# Altium project OPAMP_TESTER.PrjPcb
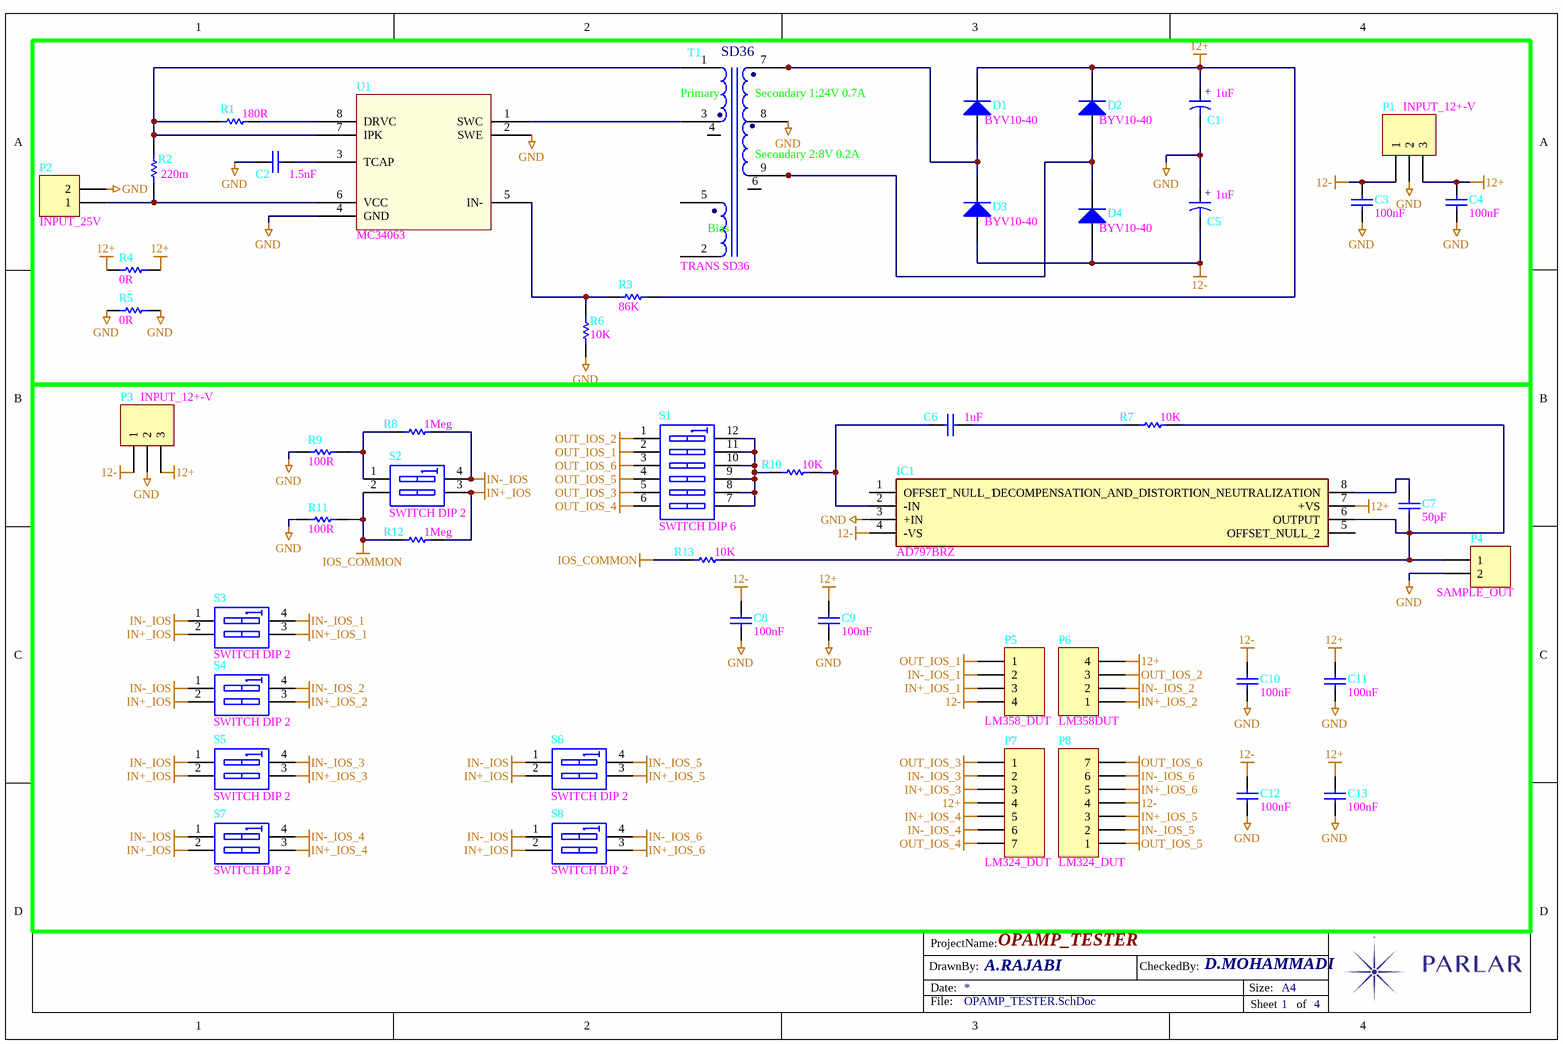
[diagram p0: OPAMP_TESTER.SchDoc]
4 sheets, 139 parts. Net scope: global (net labels, ports and power ports of the same name join across sheets).
Board files: OPAMP_TESTER.PcbDoc, OPAMP_TESTERh.PcbDoc
Sheets:
  OPAMP_TESTER.SchDoc
  OPAMP_TESTER_1.SchDoc
  OPAMP_TESTER_2.SchDoc
  OPAMP_TESTER_3.SchDoc

## Sheet OPAMP_TESTER.SchDoc: OPAMP_TESTER
size A4; CheckedBy: D.MOHAMMADI; DrawnBy: A.RAJABI; SheetNumber: 1; SheetTotal: 4

### Parts
C1  1uF  [CAP EL D06.3 P2.5]
C2  1.5nF  [SMD 0805]
C3  100nF  [SMD 0805]
C4  100nF  [SMD 0805]
C5  1uF  [CAP EL D06.3 P2.5]
C6  1uF  [SMD 1206]
C7  50pF  [SMD 1206]
C8  100nF  [SMD 0805]
C9  100nF  [SMD 0805]
C10  100nF  [SMD 0805]
C11  100nF  [SMD 0805]
C12  100nF  [SMD 0805]
C13  100nF  [SMD 0805]
D1  BYV10-40  [SMD SMA]
D2  BYV10-40  [SMD SMA]
D3  BYV10-40  [SMD SMA]
D4  BYV10-40  [SMD SMA]
IC1  AD797BRZ  [SOIC127P600X175-8N]
P1  INPUT_12+-V  [CON XH 3]
P2  INPUT_25V  [CON XH RA 2]
P3  INPUT_12+-V  [CON XH 3]
P4  SAMPLE_OUT  [CON XH 2]
P5  LM358_DUT  [CON HDR 2.54FM 4]
P6  LM358DUT  [CON HDR 2.54FM 4]
P7  LM324_DUT  [CON HDR 2.54FM 7]
P8  LM324_DUT  [CON HDR 2.54FM 7]
R1  180R  [SMD 0805]
R2  220m  [SMD 0805]
R3  86K  [SMD 1206]
R4  0R  [SMD 1206]
R5  0R  [SMD 1206]
R6  10K  [SMD 0805]
R7  10K  [SMD 0805]
R8  1Meg  [SMD 0805]
R9  100R  [SMD 0805]
R10  10K  [SMD 1206]
R11  100R  [SMD 0805]
R12  1Meg  [SMD 0805]
R13  10K  [SMD 0805]
S1  SWITCH DIP 6  [SWITCH DIP 6]
S2  SWITCH DIP 2  [SWITCH DIP 2]
S3  SWITCH DIP 2  [SWITCH DIP 2]
S4  SWITCH DIP 2  [SWITCH DIP 2]
S5  SWITCH DIP 2  [SWITCH DIP 2]
S6  SWITCH DIP 2  [SWITCH DIP 2]
S7  SWITCH DIP 2  [SWITCH DIP 2]
S8  SWITCH DIP 2  [SWITCH DIP 2]
T1  TRANS SD36  [TR EC28/20 VER 5+5]
U1  MC34063  [SMD IC SOP8]

### Nets
12+: C1.1 C4.2 C9.2 C11.2 C13.2 D1.2 D2.2 IC1.7(+VS) P1.3 P3.3 P6.4 P7.4 R3.2 R4.1 R4.2
12-: C3.2 C5.2 C8.2 C10.2 C12.2 D3.1 D4.1 IC1.4(-VS) P1.1 P3.1 P5.4 P8.4
GND: C1.2 C2.1 C3.1 C4.1 C5.1 C8.1 C9.1 C10.1 C11.1 C12.1 C13.1 IC1.3(+IN) P1.2 P2.2 P3.2 P4.2 R5.1 R5.2 R6.2 R9.1 R11.1 T1.8 U1.2(SWE) U1.4(GND)
IN+_IOS: R12.2 S2.3(B2) S3.2(A2) S4.2(A2) S5.2(A2) S6.2(A2) S7.2(A2) S8.2(A2)
IN+_IOS_1: P5.3 S3.3(B2)
IN+_IOS_2: P6.1 S4.3(B2)
IN+_IOS_3: P7.3 S5.3(B2)
IN+_IOS_4: P7.5 S7.3(B2)
IN+_IOS_5: P8.3 S6.3(B2)
IN+_IOS_6: P8.5 S8.3(B2)
IN-_IOS: R8.2 S2.4(B1) S3.1(A1) S4.1(A1) S5.1(A1) S6.1(A1) S7.1(A1) S8.1(A1)
IN-_IOS_1: P5.2 S3.4(B1)
IN-_IOS_2: P6.2 S4.4(B1)
IN-_IOS_3: P7.2 S5.4(B1)
IN-_IOS_4: P7.6 S7.4(B1)
IN-_IOS_5: P8.2 S6.4(B1)
IN-_IOS_6: P8.6 S8.4(B1)
IOS_COMMON: R11.2 R12.1 R13.1 S2.2(A2)
OUT_IOS_1: P5.1 S1.2(A2)
OUT_IOS_2: P6.3 S1.1(A1)
OUT_IOS_3: P7.1 S1.5(A5)
OUT_IOS_4: P7.7 S1.6(A6)
OUT_IOS_5: P8.1 S1.4(A4)
OUT_IOS_6: P8.7 S1.3(A3)
NetC2_2: C2.2 U1.3(TCAP)
NetC6_1: C6.1 R7.1
NetC6_2: C6.2 IC1.2(-IN) R10.2
NetC7_1: C7.1 IC1.8(DECOMPENSATION_AND_DISTORTION_NEUTRALIZATION)
NetC7_2: C7.2 IC1.6(OUTPUT) P4.1 R7.2 R13.2
NetD1_1: D1.1 D3.2 T1.6 T1.7
NetD2_1: D2.1 D4.2 T1.9 T1.10
NetP2_1: P2.1 R2.2 U1.6(VCC)
NetR1_1: R1.1 R2.1 T1.1 U1.7(IPK)
NetR1_2: R1.2 U1.8(DRVC)
NetR3_1: R3.1 R6.1 U1.5(IN-)
NetR8_1: R8.1 R9.2 S2.1(A1)
NetR10_1: R10.1 S1.7(B6) S1.8(B5) S1.9(B4) S1.10(B3) S1.11(B2) S1.12(B1)
NetT1_3: T1.3 U1.1(SWC)

Not connected (* = marked no-connect by the designer): IC1 1(OFFSET_NULL_1) 5(OFFSET_NULL_2); T1 2 4 5

### Notes on the sheet
- DrawnBy:
- ProjectName:
- Date:
- CheckedBy:
- Size:
- A4
- File:
- Sheet
- of
- (in symbol CAP POL) +
- (in symbol TRANS SD36) SD36; .; Primary; Secondary 1:24V 0.7A; Secondary 2:8V 0.2A; Bias

### Library data of the parts
C1 C5 = CAP POL: Capacitor  Polarized; Published: 23-Sep-2002; PackageReference: CAPR5-4X5; Publisher: Altium Limited; PackageDescription: Capacitor; 2 Leads; Parameter 1: *
C2-C4 C6-C13 = CAP: Capacitor; Published: 8-Jun-2000; LatestRevisionDate: 17-Jul-2002; LatestRevisionNote: Re-released for DXP Platform.; PackageReference: RAD-0.3; Publisher: Altium Limited; PackageDescription: Radial Cap, Thru-Hole; 2 Leads; 0.3 in Pin Spacing
D1-D4 = DIODE: Typical Diode
IC1 = AD797BRZ: Integrated Circuit; Manufacturer_Name: Analog Devices; Datasheet Link: http://www.analog.com/static/imported-files/data_sheets/AD797.pdf; Height: 1.75mm; Manufacturer_Part_Number: AD797BRZ; Mouser Part Number: 584-AD797BRZ; Mouser Price/Stock: https://www.mouser.co.uk/ProductDetail/Analog-Devices/AD797BRZ?qs=%2FtpEQrCGXCwnXZ1Ropaiug%3D%3D; Arrow Part Number: AD797BRZ; Arrow Price/Stock: https://www.arrow.com/en/products/ad797brz/analog-devices?region=nac
P1 P3 = CONNECTOR 3: Header, 3-Pin; LatestRevisionDate: 17-Jul-2002; LatestRevisionNote: Re-released for DXP Platform.; Publisher: Altium Limited
P2 P4 = CONNECTOR 2: Header, 2-Pin; LatestRevisionDate: 17-Jul-2002; LatestRevisionNote: Re-released for DXP Platform.; Publisher: Altium Limited
P5 P6 = CONNECTOR 4: Header, 4-Pin; LatestRevisionDate: 17-Jul-2002; LatestRevisionNote: Re-released for DXP Platform.; Publisher: Altium Limited
P7 P8 = CONNECTOR 7: Header, 7-Pin; LatestRevisionDate: 17-Jul-2002; LatestRevisionNote: Re-released for DXP Platform.; Publisher: Altium Limited
R1-R13 = RES: Resistor
S1 = SWITCH DIP 6: DIP Switch, 6 Position, SPST; Published: 24-Mar-1999; LatestRevisionDate: 17-Jul-2002; LatestRevisionNote: Re-released for DXP Platform.; PackageReference: DIP-12/SW; Publisher: Altium Limited; PackageDescription: DIP Switch; 12 Leads
S2-S8 = SWITCH DIP 2: DIP Switch, 2 Position, SPST; Published: 24-Mar-1999; LatestRevisionDate: 17-Jul-2002; LatestRevisionNote: Re-released for DXP Platform.; PackageReference: DIP-4; Publisher: Altium Limited
T1 = TRANS SD36: Transformer
U1 = IC MC34063

## Sheet OPAMP_TESTER_1.SchDoc
size A4; SheetNumber: 2; SheetTotal: 4
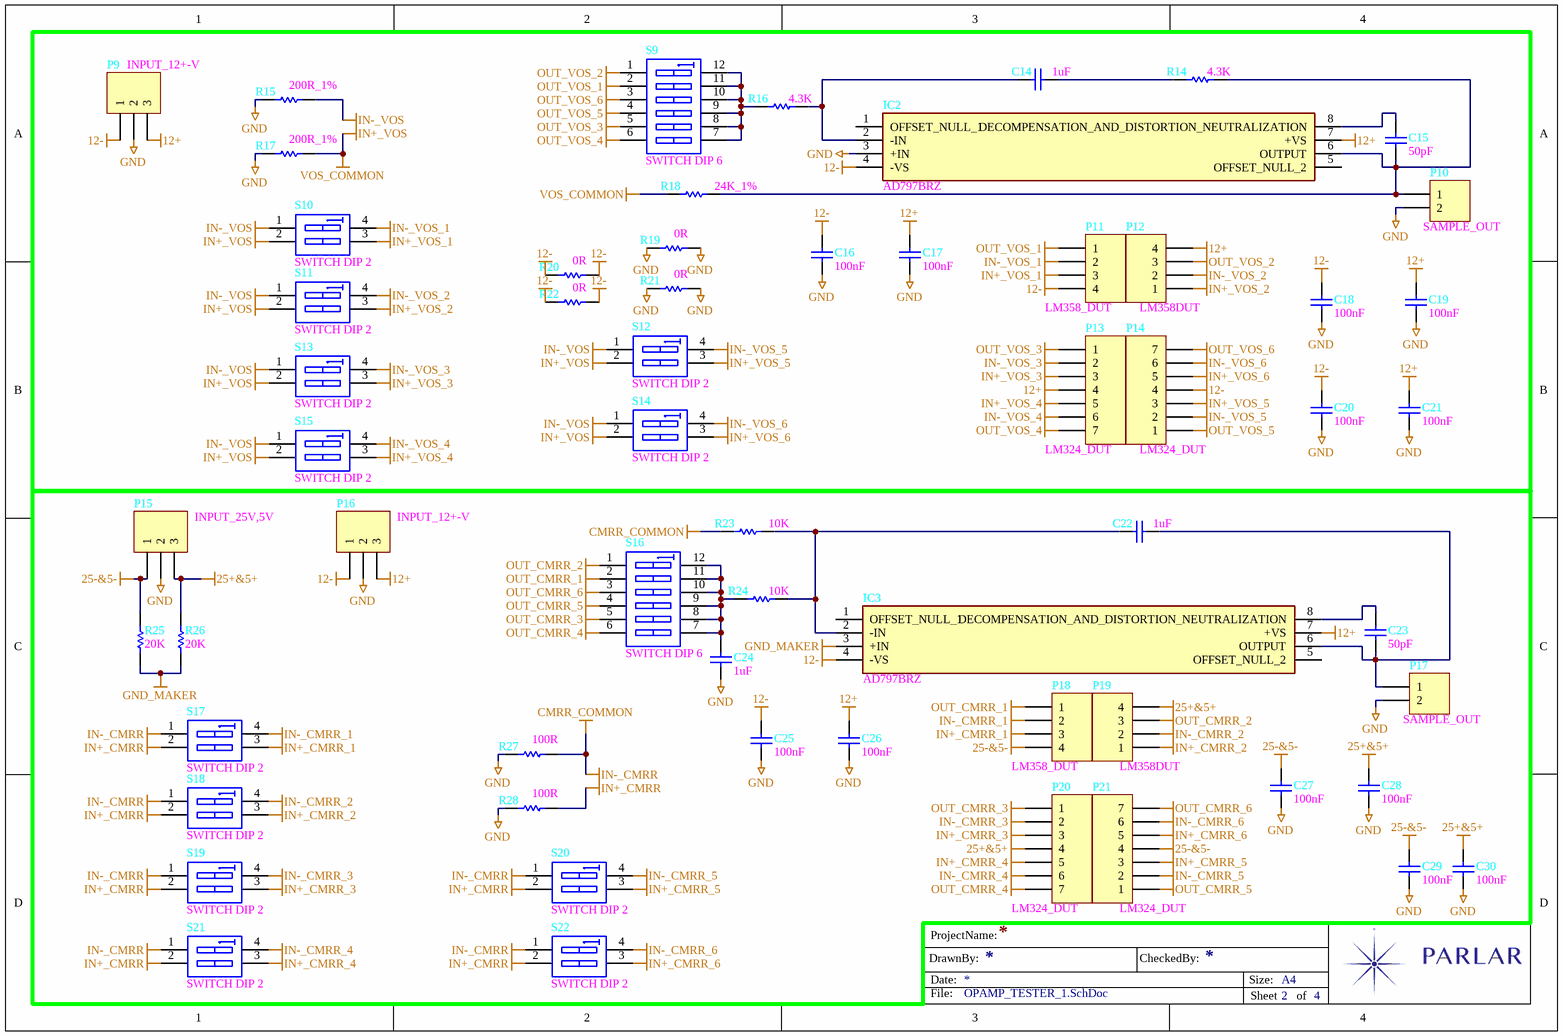
[diagram p1: OPAMP_TESTER_1.SchDoc]

### Parts
C14  1uF  [SMD 1206]
C15  50pF  [SMD 1206]
C16  100nF  [SMD 0805]
C17  100nF  [SMD 0805]
C18  100nF  [SMD 0805]
C19  100nF  [SMD 0805]
C20  100nF  [SMD 0805]
C21  100nF  [SMD 0805]
C22  1uF  [SMD 1206]
C23  50pF  [SMD 1206]
C24  1uF  [SMD 0805]
C25  100nF  [SMD 0805]
C26  100nF  [SMD 0805]
C27  100nF  [SMD 0805]
C28  100nF  [SMD 0805]
C29  100nF  [SMD 0805]
C30  100nF  [SMD 0805]
IC2  AD797BRZ  [SOIC127P600X175-8N]
IC3  AD797BRZ  [SOIC127P600X175-8N]
P9  INPUT_12+-V  [CON XH 3]
P10  SAMPLE_OUT  [CON XH 2]
P11  LM358_DUT  [CON HDR 2.54FM 4]
P12  LM358DUT  [CON HDR 2.54FM 4]
P13  LM324_DUT  [CON HDR 2.54FM 7]
P14  LM324_DUT  [CON HDR 2.54FM 7]
P15  INPUT_25V,5V  [CON XH 3]
P16  INPUT_12+-V  [CON XH 3]
P17  SAMPLE_OUT  [CON XH 2]
P18  LM358_DUT  [CON HDR 2.54FM 4]
P19  LM358DUT  [CON HDR 2.54FM 4]
P20  LM324_DUT  [CON HDR 2.54FM 7]
P21  LM324_DUT  [CON HDR 2.54FM 7]
R14  4.3K  [SMD 0805]
R15  200R_1%  [SMD 0805]
R16  4.3K  [SMD 1206]
R17  200R_1%  [SMD 0805]
R18  24K_1%  [SMD 0805]
R19  0R  [SMD 1206]
R20  0R  [SMD 1206]
R21  0R  [SMD 1206]
R22  0R  [SMD 1206]
R23  10K  [SMD 0805]
R24  10K  [SMD 0805]
R25  20K  [SMD 0805]
R26  20K  [SMD 0805]
R27  100R  [SMD 0805]
R28  100R  [SMD 0805]
S9  SWITCH DIP 6  [SWITCH DIP 6]
S10  SWITCH DIP 2  [SWITCH DIP 2]
S11  SWITCH DIP 2  [SWITCH DIP 2]
S12  SWITCH DIP 2  [SWITCH DIP 2]
S13  SWITCH DIP 2  [SWITCH DIP 2]
S14  SWITCH DIP 2  [SWITCH DIP 2]
S15  SWITCH DIP 2  [SWITCH DIP 2]
S16  SWITCH DIP 6  [SWITCH DIP 6]
S17  SWITCH DIP 2  [SWITCH DIP 2]
S18  SWITCH DIP 2  [SWITCH DIP 2]
S19  SWITCH DIP 2  [SWITCH DIP 2]
S20  SWITCH DIP 2  [SWITCH DIP 2]
S21  SWITCH DIP 2  [SWITCH DIP 2]
S22  SWITCH DIP 2  [SWITCH DIP 2]

### Nets
12+: C17.2 C19.2 C21.2 C26.2 IC2.7(+VS) IC3.7(+VS) P9.3 P12.4 P13.4 P16.3
12-: C16.2 C18.2 C20.2 C25.2 IC2.4(-VS) IC3.4(-VS) P9.1 P11.4 P14.4 P16.1 R20.1 R20.2 R22.1 R22.2
25+&5+: C28.2 C30.2 P15.3 P19.4 P20.4 R26.2
25-&5-: C27.2 C29.2 P15.1 P18.4 P21.4 R25.2
CMRR_COMMON: R23.1 R27.2 S17.1(A1) S18.1(A1) S19.1(A1) S20.1(A1) S21.1(A1) S22.1(A1)  [also labelled IN-_CMRR]
GND: C16.1 C17.1 C18.1 C19.1 C20.1 C21.1 C24.1 C25.1 C26.1 C27.1 C28.1 C29.1 C30.1 IC2.3(+IN) P9.2 P10.2 P15.2 P16.2 P17.2 R15.1 R17.1 R19.1 R19.2 R21.1 R21.2 R27.1 R28.1
GND_MAKER: IC3.3(+IN) R25.1 R26.1
IN+_CMRR: R28.2 S17.2(A2) S18.2(A2) S19.2(A2) S20.2(A2) S21.2(A2) S22.2(A2)
IN+_CMRR_1: P18.3 S17.3(B2)
IN+_CMRR_2: P19.1 S18.3(B2)
IN+_CMRR_3: P20.3 S19.3(B2)
IN+_CMRR_4: P20.5 S21.3(B2)
IN+_CMRR_5: P21.3 S20.3(B2)
IN+_CMRR_6: P21.5 S22.3(B2)
IN+_VOS: R17.2 R18.1 S10.2(A2) S11.2(A2) S12.2(A2) S13.2(A2) S14.2(A2) S15.2(A2)  [also labelled VOS_COMMON]
IN+_VOS_1: P11.3 S10.3(B2)
IN+_VOS_2: P12.1 S11.3(B2)
IN+_VOS_3: P13.3 S13.3(B2)
IN+_VOS_4: P13.5 S15.3(B2)
IN+_VOS_5: P14.3 S12.3(B2)
IN+_VOS_6: P14.5 S14.3(B2)
IN-_CMRR_1: P18.2 S17.4(B1)
IN-_CMRR_2: P19.2 S18.4(B1)
IN-_CMRR_3: P20.2 S19.4(B1)
IN-_CMRR_4: P20.6 S21.4(B1)
IN-_CMRR_5: P21.2 S20.4(B1)
IN-_CMRR_6: P21.6 S22.4(B1)
IN-_VOS: R15.2 S10.1(A1) S11.1(A1) S12.1(A1) S13.1(A1) S14.1(A1) S15.1(A1)
IN-_VOS_1: P11.2 S10.4(B1)
IN-_VOS_2: P12.2 S11.4(B1)
IN-_VOS_3: P13.2 S13.4(B1)
IN-_VOS_4: P13.6 S15.4(B1)
IN-_VOS_5: P14.2 S12.4(B1)
IN-_VOS_6: P14.6 S14.4(B1)
OUT_CMRR_1: P18.1 S16.2(A2)
OUT_CMRR_2: P19.3 S16.1(A1)
OUT_CMRR_3: P20.1 S16.5(A5)
OUT_CMRR_4: P20.7 S16.6(A6)
OUT_CMRR_5: P21.1 S16.4(A4)
OUT_CMRR_6: P21.7 S16.3(A3)
OUT_VOS_1: P11.1 S9.2(A2)
OUT_VOS_2: P12.3 S9.1(A1)
OUT_VOS_3: P13.1 S9.5(A5)
OUT_VOS_4: P13.7 S9.6(A6)
OUT_VOS_5: P14.1 S9.4(A4)
OUT_VOS_6: P14.7 S9.3(A3)
NetC14_1: C14.1 R14.1
NetC14_2: C14.2 IC2.2(-IN) R16.2
NetC15_1: C15.1 IC2.8(DECOMPENSATION_AND_DISTORTION_NEUTRALIZATION)
NetC15_2: C15.2 IC2.6(OUTPUT) P10.1 R14.2 R18.2
NetC22_1: C22.1 C23.2 IC3.6(OUTPUT) P17.1
NetC22_2: C22.2 IC3.2(-IN) R23.2 R24.2
NetC23_1: C23.1 IC3.8(DECOMPENSATION_AND_DISTORTION_NEUTRALIZATION)
NetC24_2: C24.2 R24.1 S16.7(B6) S16.8(B5) S16.9(B4) S16.10(B3) S16.11(B2) S16.12(B1)
NetR16_1: R16.1 S9.7(B6) S9.8(B5) S9.9(B4) S9.10(B3) S9.11(B2) S9.12(B1)

Not connected (* = marked no-connect by the designer): IC2 1(OFFSET_NULL_1) 5(OFFSET_NULL_2); IC3 1(OFFSET_NULL_1) 5(OFFSET_NULL_2)

### Notes on the sheet
- DrawnBy:
- ProjectName:
- Date:
- CheckedBy:
- Size:
- A4
- File:
- Sheet
- of

### Library data of the parts
C14-C30 = CAP: Capacitor; Published: 8-Jun-2000; LatestRevisionDate: 17-Jul-2002; LatestRevisionNote: Re-released for DXP Platform.; PackageReference: RAD-0.3; Publisher: Altium Limited; PackageDescription: Radial Cap, Thru-Hole; 2 Leads; 0.3 in Pin Spacing
IC2 IC3 = AD797BRZ: as IC1 on sheet OPAMP_TESTER; Datasheet Link: http://www.analog.com/static/imported-files/data_sheets/AD797.pdf; Height: 1.75mm; Manufacturer_Part_Number: AD797BRZ; Mouser Part Number: 584-AD797BRZ; Mouser Price/Stock: https://www.mouser.co.uk/ProductDetail/Analog-Devices/AD797BRZ?qs=%2FtpEQrCGXCwnXZ1Ropaiug%3D%3D; Arrow Part Number: AD797BRZ; Arrow Price/Stock: https://www.arrow.com/en/products/ad797brz/analog-devices?region=nac
P9 P15 P16 = CONNECTOR 3: Header, 3-Pin; LatestRevisionDate: 17-Jul-2002; LatestRevisionNote: Re-released for DXP Platform.; Publisher: Altium Limited
P10 P17 = CONNECTOR 2: Header, 2-Pin; LatestRevisionDate: 17-Jul-2002; LatestRevisionNote: Re-released for DXP Platform.; Publisher: Altium Limited
P11 P12 P18 P19 = CONNECTOR 4: Header, 4-Pin; LatestRevisionDate: 17-Jul-2002; LatestRevisionNote: Re-released for DXP Platform.; Publisher: Altium Limited
P13 P14 P20 P21 = CONNECTOR 7: Header, 7-Pin; LatestRevisionDate: 17-Jul-2002; LatestRevisionNote: Re-released for DXP Platform.; Publisher: Altium Limited
R14-R28 = RES: Resistor
S9 S16 = SWITCH DIP 6: DIP Switch, 6 Position, SPST; Published: 24-Mar-1999; LatestRevisionDate: 17-Jul-2002; LatestRevisionNote: Re-released for DXP Platform.; PackageReference: DIP-12/SW; Publisher: Altium Limited; PackageDescription: DIP Switch; 12 Leads
S10-S15 S17-S22 = SWITCH DIP 2: DIP Switch, 2 Position, SPST; Published: 24-Mar-1999; LatestRevisionDate: 17-Jul-2002; LatestRevisionNote: Re-released for DXP Platform.; PackageReference: DIP-4; Publisher: Altium Limited

## Sheet OPAMP_TESTER_2.SchDoc
size A4; SheetNumber: 3; SheetTotal: 4
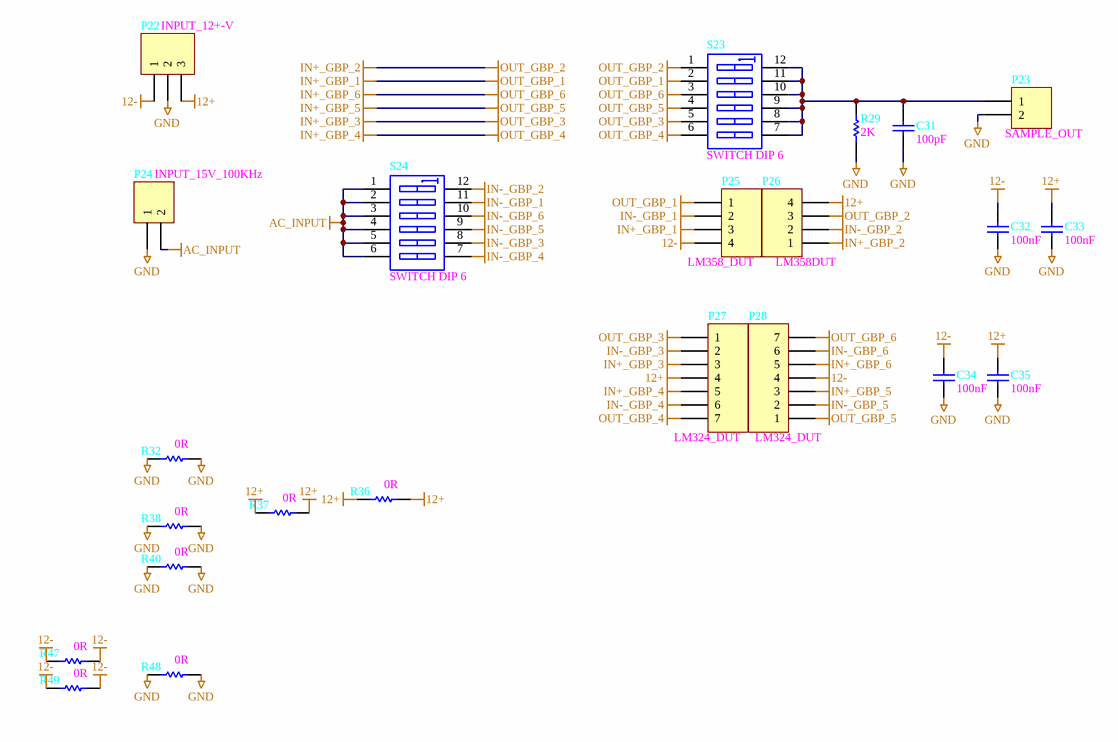
[diagram p2: OPAMP_TESTER_2.SchDoc]

### Parts
C31  100pF  [SMD 0805]
C32  100nF  [SMD 0805]
C33  100nF  [SMD 0805]
C34  100nF  [SMD 1206]
C35  100nF  [SMD 1206]
P22  INPUT_12+-V  [CON XH 3]
P23  SAMPLE_OUT  [CON XH 2]
P24  INPUT_15V_100KHz  [CON XH 2]
P25  LM358_DUT  [CON HDR 2.54FM 4]
P26  LM358DUT  [CON HDR 2.54FM 4]
P27  LM324_DUT  [CON HDR 2.54FM 7]
P28  LM324_DUT  [CON HDR 2.54FM 7]
R29  2K  [SMD 0805]
R32  0R  [SMD 1206]
R36  0R  [SMD 1206]
R37  0R  [SMD 1206]
R38  0R  [SMD 1206]
R40  0R  [SMD 1206]
R47  0R  [SMD 1206]
R48  0R  [SMD 1206]
R49  0R  [SMD 1206]
S23  SWITCH DIP 6  [SWITCH DIP 6]
S24  SWITCH DIP 6  [SWITCH DIP 6]

### Nets
12+: C33.2 C35.2 P22.3 P26.4 P27.4 R36.1 R36.2 R37.1 R37.2
12-: C32.2 C34.2 P22.1 P25.4 P28.4 R47.1 R47.2 R49.1 R49.2
AC_INPUT: P24.2 S24.1(A1) S24.2(A2) S24.3(A3) S24.4(A4) S24.5(A5) S24.6(A6)
GND: C31.1 C32.1 C33.1 C34.1 C35.1 P22.2 P23.2 P24.1 R29.2 R32.1 R32.2 R38.1 R38.2 R40.1 R40.2 R48.1 R48.2
IN+_GBP_1: P25.1 P25.3 S23.2(A2)  [also labelled OUT_GBP_1]
IN+_GBP_2: P26.1 P26.3 S23.1(A1)  [also labelled OUT_GBP_2]
IN+_GBP_3: P27.1 P27.3 S23.5(A5)  [also labelled OUT_GBP_3]
IN+_GBP_4: P27.5 P27.7 S23.6(A6)  [also labelled OUT_GBP_4]
IN+_GBP_5: P28.1 P28.3 S23.4(A4)  [also labelled OUT_GBP_5]
IN+_GBP_6: P28.5 P28.7 S23.3(A3)  [also labelled OUT_GBP_6]
IN-_GBP_1: P25.2 S24.11(B2)
IN-_GBP_2: P26.2 S24.12(B1)
IN-_GBP_3: P27.2 S24.8(B5)
IN-_GBP_4: P27.6 S24.7(B6)
IN-_GBP_5: P28.2 S24.9(B4)
IN-_GBP_6: P28.6 S24.10(B3)
NetC31_2: C31.2 P23.1 R29.1 S23.7(B6) S23.8(B5) S23.9(B4) S23.10(B3) S23.11(B2) S23.12(B1)

### Notes on the sheet
- DrawnBy:
- ProjectName:
- Date:
- CheckedBy:
- Size:
- A4
- File:
- Sheet
- of

### Library data of the parts
C31-C35 = CAP: Capacitor; Published: 8-Jun-2000; LatestRevisionDate: 17-Jul-2002; LatestRevisionNote: Re-released for DXP Platform.; PackageReference: RAD-0.3; Publisher: Altium Limited; PackageDescription: Radial Cap, Thru-Hole; 2 Leads; 0.3 in Pin Spacing
P22 = CONNECTOR 3: Header, 3-Pin; LatestRevisionDate: 17-Jul-2002; LatestRevisionNote: Re-released for DXP Platform.; Publisher: Altium Limited
P23 P24 = CONNECTOR 2: Header, 2-Pin; LatestRevisionDate: 17-Jul-2002; LatestRevisionNote: Re-released for DXP Platform.; Publisher: Altium Limited
P25 P26 = CONNECTOR 4: Header, 4-Pin; LatestRevisionDate: 17-Jul-2002; LatestRevisionNote: Re-released for DXP Platform.; Publisher: Altium Limited
P27 P28 = CONNECTOR 7: Header, 7-Pin; LatestRevisionDate: 17-Jul-2002; LatestRevisionNote: Re-released for DXP Platform.; Publisher: Altium Limited
R29 R32 R36-R38 R40 R47-R49 = RES: Resistor
S23 S24 = SWITCH DIP 6: DIP Switch, 6 Position, SPST; Published: 24-Mar-1999; LatestRevisionDate: 17-Jul-2002; LatestRevisionNote: Re-released for DXP Platform.; PackageReference: DIP-12/SW; Publisher: Altium Limited; PackageDescription: DIP Switch; 12 Leads

## Sheet OPAMP_TESTER_3.SchDoc
size A4; SheetNumber: 4; SheetTotal: 4
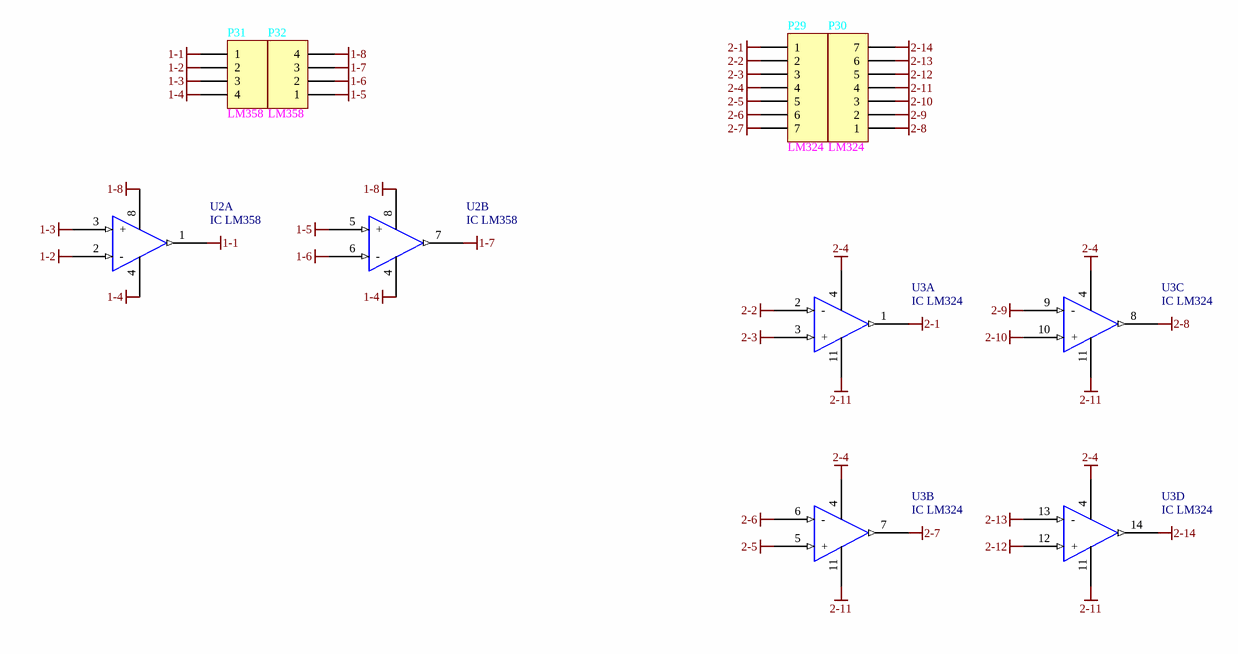
[diagram p3: OPAMP_TESTER_3.SchDoc]

### Parts
P29  LM324  [CON HDR 2.54FM 7]
P30  LM324  [CON HDR 2.54FM 7]
P31  LM358  [CON HDR 2.54FM 4]
P32  LM358  [CON HDR 2.54FM 4]
U2  IC LM358  [SMD IC SOP8]  (parts A,B of 2)
U3  IC LM324  [SMD IC SOP14]  (parts A,B,C,D of 4)

### Nets
1-1: P31.1 U2.1(OUT1)
1-2: P31.2 U2.2(-)
1-3: P31.3 U2.3(+)
1-4: P31.4 U2.4(GND)
1-5: P32.1 U2.5(+)
1-6: P32.2 U2.6(-)
1-7: P32.3 U2.7(OUT1)
1-8: P32.4 U2.8(VCC)
2-1: P29.1 U3.1(OUT1)
2-2: P29.2 U3.2(-)
2-3: P29.3 U3.3(+)
2-4: P29.4 U3.4(VCC)
2-5: P29.5 U3.5(+)
2-6: P29.6 U3.6(-)
2-7: P29.7 U3.7(OUT1)
2-8: P30.1 U3.8(OUT1)
2-9: P30.2 U3.9(-)
2-10: P30.3 U3.10(+)
2-11: P30.4 U3.11(GND)
2-12: P30.5 U3.12(+)
2-13: P30.6 U3.13(-)
2-14: P30.7 U3.14(OUT1)

### Notes on the sheet
- DrawnBy:
- ProjectName:
- Date:
- CheckedBy:
- Size:
- A4
- File:
- Sheet
- of

### Library data of the parts
P29 P30 = CONNECTOR 7: Header, 7-Pin; LatestRevisionDate: 17-Jul-2002; LatestRevisionNote: Re-released for DXP Platform.; Publisher: Altium Limited
P31 P32 = CONNECTOR 4: Header, 4-Pin; LatestRevisionDate: 17-Jul-2002; LatestRevisionNote: Re-released for DXP Platform.; Publisher: Altium Limited

## Nets that join several sheets
12+: OPAMP_TESTER (15 pins), OPAMP_TESTER_1 (10 pins), OPAMP_TESTER_2 (9 pins)
12-: OPAMP_TESTER (12 pins), OPAMP_TESTER_1 (14 pins), OPAMP_TESTER_2 (9 pins)
GND: OPAMP_TESTER (24 pins), OPAMP_TESTER_1 (27 pins), OPAMP_TESTER_2 (17 pins)